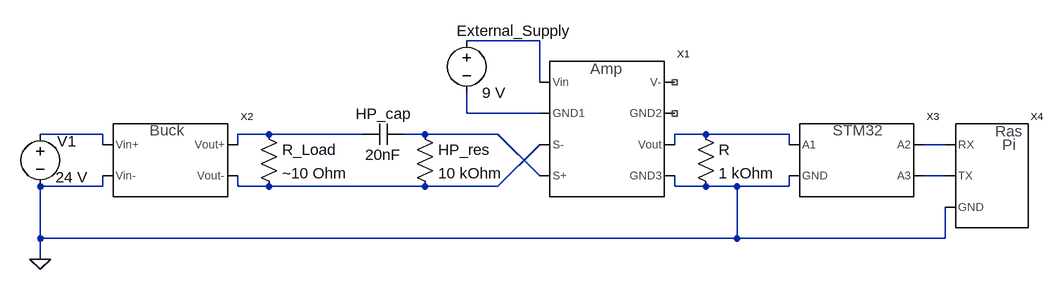
[diagram p0: schematic sample_circuit.asc]
sample_circuit.asc, the LTspice schematic file:
Version 4
SHEET 1 1604 680
WIRE 768 -80 656 -80
WIRE 768 -16 768 -80
WIRE 656 32 656 0
WIRE 768 32 656 32
WIRE 96 64 0 64
WIRE 352 64 304 64
WIRE 496 64 352 64
WIRE 592 64 560 64
WIRE 704 64 592 64
WIRE 1024 64 976 64
WIRE 1152 64 1024 64
WIRE 96 80 96 64
WIRE 304 80 304 64
WIRE 976 80 976 64
WIRE 1152 80 1152 64
WIRE 1392 80 1360 80
WIRE 768 128 704 64
WIRE 1392 128 1360 128
WIRE 96 144 96 128
WIRE 96 144 0 144
WIRE 304 144 304 128
WIRE 352 144 304 144
WIRE 592 144 352 144
WIRE 704 144 768 80
WIRE 704 144 592 144
WIRE 976 144 976 128
WIRE 1024 144 976 144
WIRE 1072 144 1024 144
WIRE 1152 144 1152 128
WIRE 1152 144 1072 144
WIRE 0 224 0 144
WIRE 1072 224 1072 144
WIRE 1072 224 0 224
WIRE 1392 224 1392 176
WIRE 1392 224 1072 224
WIRE 0 256 0 224
FLAG 0 256 0
SYMBOL voltage 0 48 R0
WINDOW 0 26 27 Left 2
WINDOW 3 24 82 Left 2
SYMATTR InstName V1
SYMATTR Value 24 V
SYMBOL AMP 1024 144 R0
SYMATTR InstName X1
SYMBOL generic_buck 352 144 R0
SYMATTR InstName X2
SYMBOL STM 1408 144 R0
SYMATTR InstName X3
SYMBOL cap 560 48 R90
WINDOW 0 0 32 VBottom 2
WINDOW 3 32 32 VTop 2
SYMATTR InstName HP_cap
SYMATTR Value 20nF
SYMBOL res 576 48 R0
SYMATTR InstName HP_res
SYMATTR Value 10 kOhm
SYMBOL res 336 48 R0
SYMATTR InstName R_Load
SYMATTR Value ~10 Ohm
SYMBOL res 1008 48 R0
SYMATTR InstName R
SYMATTR Value 1 kOhm
SYMBOL ras_pi 1456 176 R0
SYMATTR InstName X4
SYMBOL voltage 656 -96 R0
WINDOW 0 -15 1 Left 2
WINDOW 123 0 0 Left 0
WINDOW 39 0 0 Left 0
SYMATTR InstName External_Supply
SYMATTR Value 9 V

The netlist it stands for:
* sample_circuit.asc
V1 N003 0 24 V
XX1 N005 N009 N002 N001 NC_01 NC_02 N006 0 AMP  ; pins S+ S- GND1 Vin V- GND2 Vout GND3
XX2 N003 0 N004 N009 generic_buck  ; pins Vin+ Vin- Vout+ Vout-
XX3 N006 0 N007 N008 STM  ; pins A1 GND A2 A3
C§HP_cap N005 N004 20nF
R§HP_res N005 N009 10 kOhm
R_Load N004 N009 ~10 Ohm
R N006 0 1 kOhm
XX4 N007 N008 0 ras_pi  ; pins RX TX GND
V§External_Supply N001 N002 9 V
.backanno
.end